# EAGLE design Bluetooth Bee_ Standalone v1.0 (EAGLE 6.1)
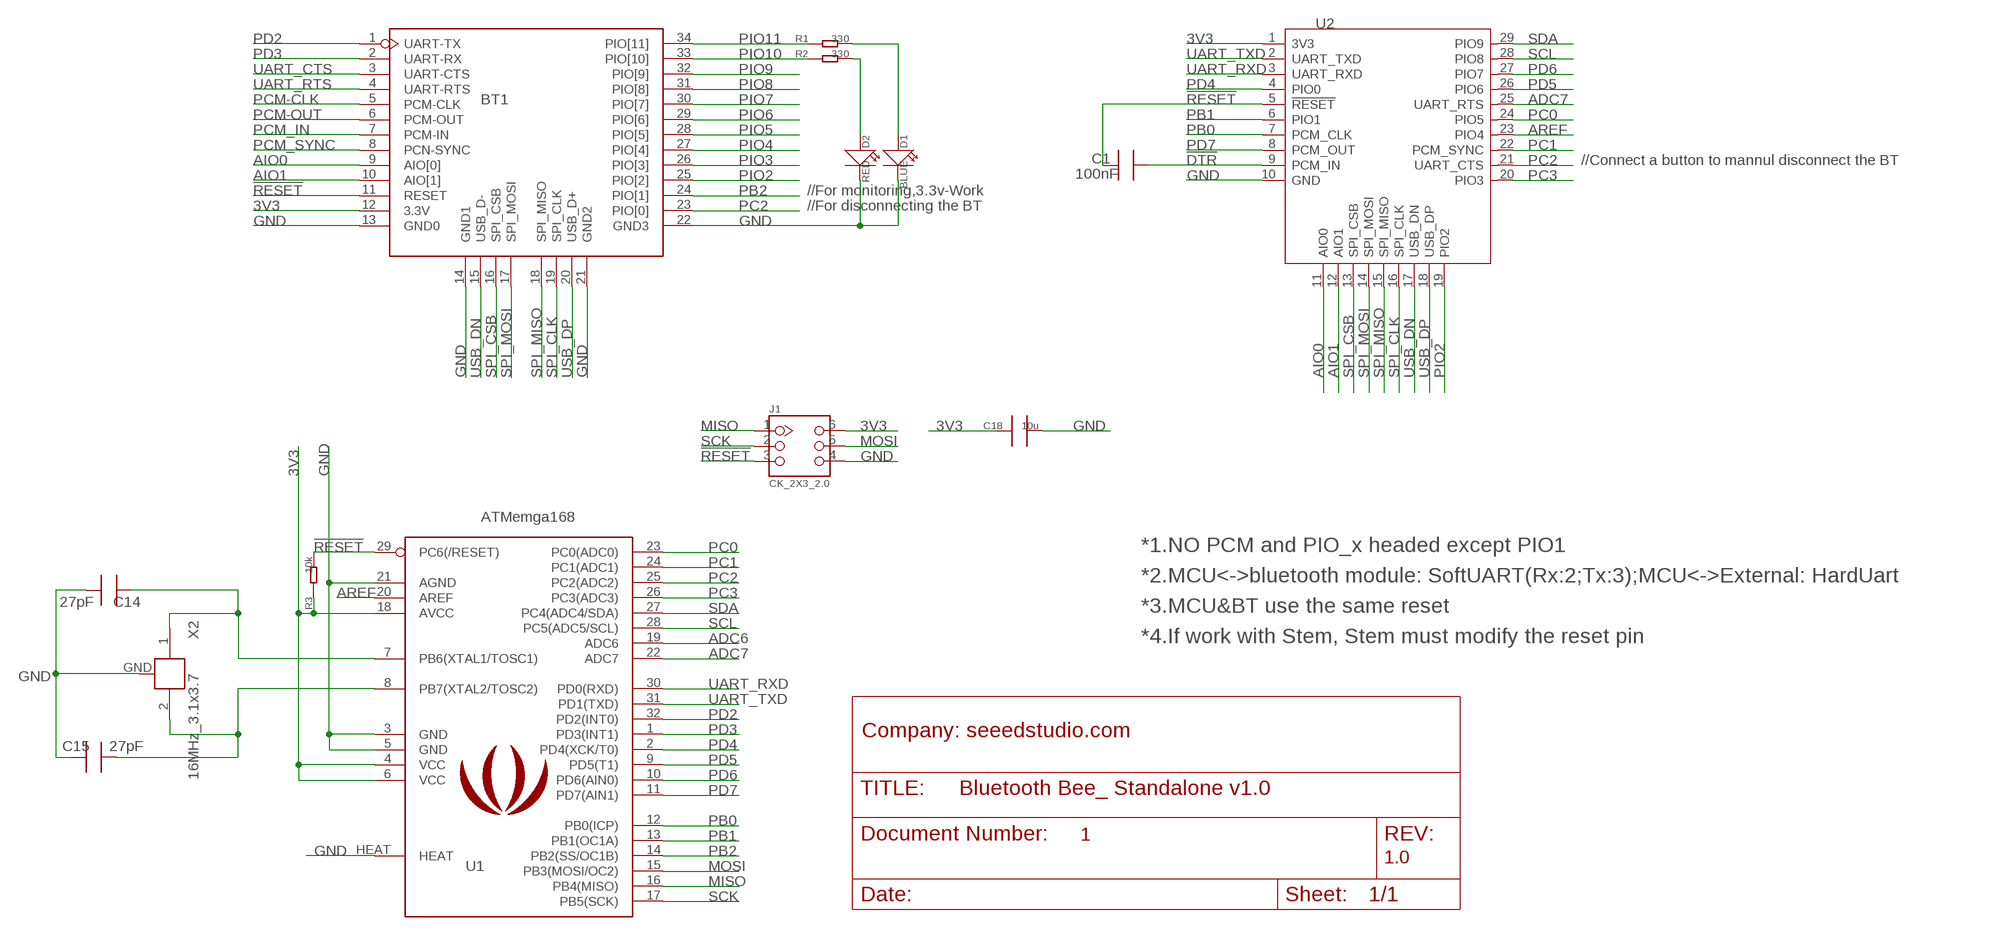
[diagram p0: schematic, sheet 1]

## Parts
BT1  SERIAL_BLUETEETHSMT  [SERIAL_BLUETEETH]
C1  100nF  C0603_S  [0603_S]
C14  27pF  C0603  [0603]
C15  27pF  C0603  [0603]
C18  10u  C0805  [0805]
D1  BLUE  LED0603  [LED0603]
D2  RED  LED0603  [LED0603]
J1  CK_2X3_2.0  [CK_2X3_2.0]
LOGO1  LOGO_SILK  [LOGO_SILK]
R1  330  R0603  [0603]
R2  330  R0603  [0603]
R3  10k  R0603_S  [0603_S@1]
U1  ATMemga168  MEGA8  [MLF32X]
U2  BLUTOOTHBEE-MS  [29P-DIP-2.0]
X2  16MHz_3.1x3.7  XTAL_NCHOZ  [XTAL_NC]

## Nets
3V3: BT1.12(3.3V) C18.1 J1.6 R3.1 U1.4(VCC) U1.6(VCC) U1.18(AVCC) U2.1(3V3)
!DTR: C1.1 U2.9(PCM_IN)
!RESET: BT1.11(RESET) C1.2 J1.3 R3.2 U1.29(PC6(/RESET)) U2.5(!RESET)
ADC6: U1.19(ADC6)
ADC7: U1.22(ADC7) U2.25(UART_RTS)
AIO0: BT1.9(AIO[0]) U2.11(AIO0)
AIO1: BT1.10(AIO[1]) U2.12(AIO1)
AREF: U1.20(AREF) U2.23(PIO4)
GND: BT1.13(GND0) BT1.14(GND1) BT1.21(GND2) BT1.22(GND3) C14.2 C15.1 C18.2 D1.2(-) D2.2(-) J1.4 U1.3(GND) U1.5(GND) U1.21(AGND) U1.HEAT U2.10(GND) X2.GND
MISO: J1.1 U1.16(PB4(MISO))
MOSI: J1.5 U1.15(PB3(MOSI/OC2))
N$1: D2.1(+) R2.2
N$2: D1.1(+) R1.2
PB0: U1.12(PB0(ICP)) U2.7(PCM_CLK)
PB1: U1.13(PB1(OC1A)) U2.6(PIO1)
PB2: BT1.24(PIO[1]) U1.14(PB2(SS/OC1B))
PC0: U1.23(PC0(ADC0)) U2.24(PIO5)
PC1: U1.24(PC1(ADC1)) U2.22(PCM_SYNC)
PC2: BT1.23(PIO[0]) U1.25(PC2(ADC2)) U2.21(UART_CTS)
PC3: U1.26(PC3(ADC3)) U2.20(PIO3)
PCM-CLK: BT1.5(PCM-CLK)
PCM-OUT: BT1.6(PCM-OUT)
PCM_IN: BT1.7(PCM-IN)
PCM_SYNC: BT1.8(PCN-SYNC)
PD2: BT1.1(UART-TX) U1.32(PD2(INT0))
PD3: BT1.2(UART-RX) U1.1(PD3(INT1))
PD4: U1.2(PD4(XCK/T0)) U2.4(PIO0)
PD5: U1.9(PD5(T1)) U2.26(PIO6)
PD6: U1.10(PD6(AIN0)) U2.27(PIO7)
PD7: U1.11(PD7(AIN1)) U2.8(PCM_OUT)
PIO2: BT1.25(PIO[2]) U2.19(PIO2)
PIO3: BT1.26(PIO[3])
PIO4: BT1.27(PIO[4])
PIO5: BT1.28(PIO[5])
PIO6: BT1.29(PIO[6])
PIO7: BT1.30(PIO[7])
PIO8: BT1.31(PIO[8])
PIO9: BT1.32(PIO[9])
PIO10: BT1.33(PIO[10]) R2.1
PIO11: BT1.34(PIO[11]) R1.1
SCK: J1.2 U1.17(PB5(SCK))
SCL: U1.28(PC5(ADC5/SCL)) U2.28(PIO8)
SDA: U1.27(PC4(ADC4/SDA)) U2.29(PIO9)
SPI_CLK: BT1.19(SPI_CLK) U2.16(SPI_CLK)
SPI_CSB: BT1.16(SPI_CSB) U2.13(SPI_CSB)
SPI_MISO: BT1.18(SPI_MISO) U2.15(SPI_MISO)
SPI_MOSI: BT1.17(SPI_MOSI) U2.14(SPI_MOSI)
UART_CTS: BT1.3(UART-CTS)
UART_RTS: BT1.4(UART-RTS)
UART_RXD: U1.30(PD0(RXD)) U2.3(UART_RXD)
UART_TXD: U1.31(PD1(TXD)) U2.2(UART_TXD)
USB_DN: BT1.15(USB_D-) U2.17(USB_DN)
USB_DP: BT1.20(USB_D+) U2.18(USB_DP)
XTAL1: C14.1 U1.7(PB6(XTAL1/TOSC1)) X2.1
XTAL2: C15.2 U1.8(PB7(XTAL2/TOSC2)) X2.2

## Notes on the sheet
- //Connect a button to mannul disconnect the BT
- //For monitoring,3.3v-Work
- //For disconnecting the BT
- *1.NO PCM and PIO_x headed except PIO1
- *2.MCU<->bluetooth module: SoftUART(Rx:2;Tx:3);MCU<->External: HardUart
- *3.MCU&BT use the same reset
- *4.If work with Stem, Stem must modify the reset pin
- Company: seeedstudio.com
- 1
- 1.0

## Library data of the parts
BT1 = EXT_moudle:SERIAL_BLUETEETH
C1 = CPT_SMD:C0603
C14 C15 = CPT_SMD:C0603; C0603: 100N
C18 = CPT_SMD:C0805
D1 D2 = CPT_SMD:LED0603
J1 = CONNECTER:CK_2X3
LOGO1 = logo:LOGO_SILK
R1-R3 = CPT_SMD:R0603
U1 = ICs_v54:MEGA8
U2 = Module:BLUTOOTHBEE-MS
X2 = CPT_SMD:XTAL_NC

## Net classes
0 default: width 0.203 mm, drill 0.305 mm, clearance 0.152 mm

## Board
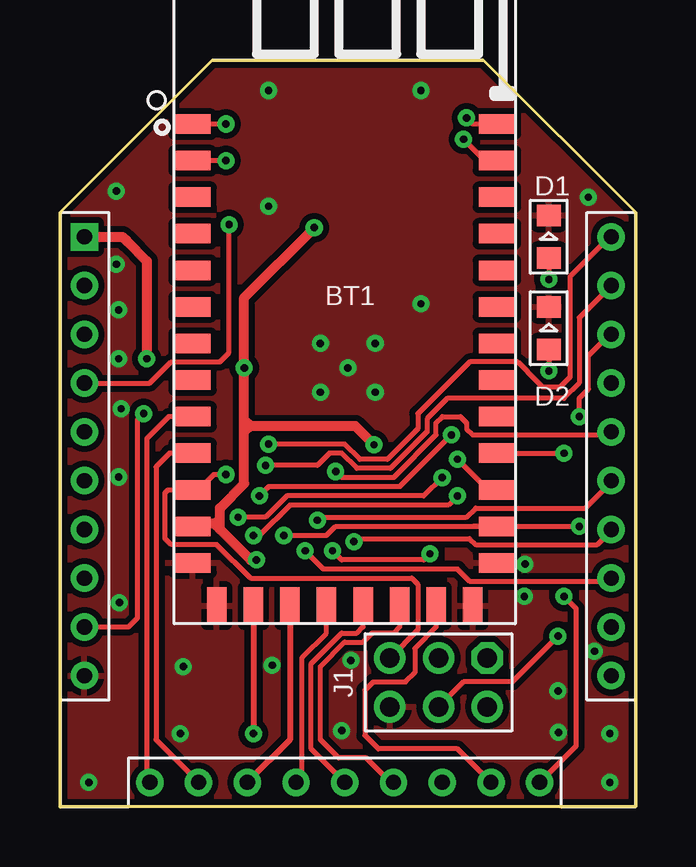
[diagram p1: board, top side]
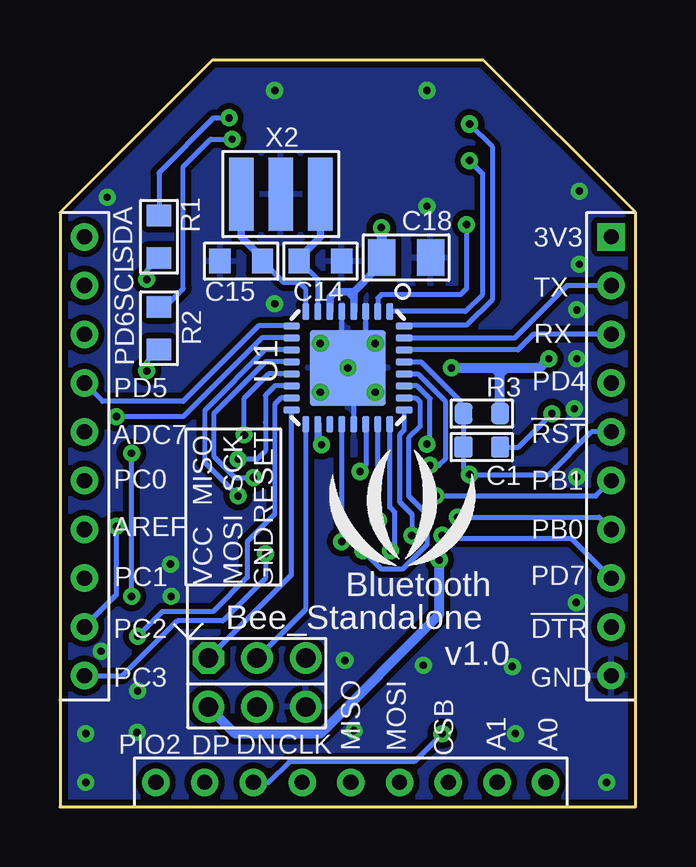
[diagram p2: board, bottom side, seen from below]

Size 24 x 31.12 mm. Coordinates in mm from the lower left corner, seen from the top.
Outline: 0,24.77 6.35,31.12 17.65,31.12 24,24.77 24,0 0,0 0,24.77
Copper layers (1*16): Top 0.035mm / dielectric 1.5mm / Bottom 0.035mm
Design rules: minimum track width 5mil, minimum drill 12mil, track to track 6mil, track to pad 6mil, pad to pad 6mil, via to via 6mil, smd to smd 0mil, copper to edge 10mil, drill to drill 8mil, minimum pad ring 10mil, minimum via ring 8mil, stop-mask expansion 4mil, vias tented up to drill 100mil, thermal gap 10mil

### Footprints (pad centres in the part's own frame; a part is rotated, then mirrored left to right if it is on the bottom)
SERIAL_BLUETEETH = smd 1.524 x 0.813: 1 -6.35,0; 2 -6.35,-1.524; 3 -6.35,-3.048; 4 -6.35,-4.572; 5 -6.35,-6.096; 6 -6.35,-7.62; 7 -6.35,-9.144; 8 -6.35,-10.668; 9 -6.35,-12.192; 10 -6.35,-13.716; 11 -6.35,-15.24; 12 -6.35,-16.764; 13 -6.35,-18.288; 22 6.35,-18.288; 23 6.35,-16.764; 24 6.35,-15.24; 25 6.35,-13.716; 26 6.35,-12.192; 27 6.35,-10.668; 28 6.35,-9.144; 29 6.35,-7.62; 30 6.35,-6.096; 31 6.35,-4.572; 32 6.35,-3.048; 33 6.35,-1.524; 34 6.35,0 | smd 0.813 x 1.524: 14 -5.334,-20.066; 15 -3.81,-20.066; 16 -2.286,-20.066; 17 -0.762,-20.066; 18 0.762,-20.066; 19 2.286,-20.066; 20 3.81,-20.066; 21 5.334,-20.066
0603_S = smd 0.762 x 0.889: 1 -0.762,0; 2 0.762,0
0603 = smd 0.889 x 1.016: 1 -0.889,0; 2 0.889,0
0805 = smd 1.143 x 1.524: 1 -1.016,0; 2 1.016,0
LED0603 = smd 0.889 x 1.016: 1 -0.889,0; 2 0.889,0
CK_2X3_2.0 = drill 0.813 pad 1.27 octagon: 1 -1.016,2.032 | drill 0.813 pad 1.27: 2 -1.016,0; 3 -1.016,-2.032; 4 1.016,-2.032; 5 1.016,0; 6 1.016,2.032
0603_S@1 = smd 0.762 x 0.889: 1 -0.762,0; 2 0.762,0
MLF32X = smd 0.7 x 0.3: 1 -2.35,1.75; 2 -2.35,1.25; 3 -2.35,0.75; 4 -2.35,0.25; 5 -2.35,-0.25; 6 -2.35,-0.75; 7 -2.35,-1.25; 8 -2.35,-1.75; 17 2.35,-1.75; 18 2.35,-1.25; 19 2.35,-0.75; 20 2.35,-0.25; 21 2.35,0.25; 22 2.35,0.75; 23 2.35,1.25; 24 2.35,1.75 | smd 0.3 x 0.7: 9 -1.75,-2.35; 10 -1.25,-2.35; 11 -0.75,-2.35; 12 -0.25,-2.35; 13 0.25,-2.35; 14 0.75,-2.35; 15 1.25,-2.35; 16 1.75,-2.35; 25 1.75,2.35; 26 1.25,2.35; 27 0.75,2.35; 28 0.25,2.35; 29 -0.25,2.35; 30 -0.75,2.35; 31 -1.25,2.35; 32 -1.75,2.35 | smd 3.175 x 3.175: HEAT 0,0
29P-DIP-2.0 = drill 0.635 pad 1.143 square: 1 -10.986,8.128 | drill 0.635 pad 1.143: 2 -10.986,6.096; 3 -10.986,4.064; 4 -10.986,2.032; 5 -10.986,0; 6 -10.986,-2.032; 7 -10.986,-4.064; 8 -10.986,-6.096; 9 -10.986,-8.128; 10 -10.986,-10.16; 11 -8.255,-14.605; 12 -6.223,-14.605; 13 -4.191,-14.605; 14 -2.159,-14.605; 15 -0.127,-14.605; 16 1.905,-14.605; 17 3.937,-14.605; 18 5.969,-14.605; 19 8.001,-14.605; 20 10.986,-10.16; 21 10.986,-8.128; 22 10.986,-6.096; 23 10.986,-4.064; 24 10.986,-2.032; 25 10.986,0; 26 10.986,2.032; 27 10.986,4.064; 28 10.986,6.096; 29 10.986,8.128
XTAL_NC = smd 1.016 x 3.048: 1 -1.651,0; 2 1.651,0; GND 0,0

### Placement (x,y rotation side)
BT1  11.87,28.45 0 top
C1  6.41,14.99 180 bottom
C14  13.14,22.73 0 bottom
C15  16.45,22.73 0 bottom
C18  9.56,22.89 0 bottom
D1  20.38,23.75 90 top
D2  20.38,19.94 90 top
J1  15.79,5.18 270 top
LOGO1  9.74,11.73 0 bottom
R1  19.88,23.75 270 bottom
R2  19.88,19.94 270 bottom
R3  6.41,16.38 180 bottom
U1  12,18.29 270 bottom
U2  12,15.62 0 top
X2  14.8,25.53 180 bottom

### Tracks (layer width: path | path; a pad name or v marks a point on that pad's centre or on a via)
3V3  (via drill 0.3 pad 0.64)
  Top 0.406: 7.68,15.62 7.68,15.88 | 7.68,15.88 7.68,16.13 | 7.68,15.88 7.94,15.88 | 7.94,15.88 7.68,16.13 | 7.68,15.62 7.94,15.88 | 7.68,16.13 v7.68,18.29 7.68,21.21 v10.6,24.13 | 7.94,15.88 12.31,15.88 v13.09,15.09 | BT1.12 5.65,11.81 6.41,11.81 | 7.68,15.62 7.68,13.46 6.67,12.45 6.67,11.99 | v3.62,18.67 3.62,22.73 2.79,23.56 2.6,23.75 U2.1 | v8.19,10.29 7.94,10.29 6.67,11.56 | 6.67,11.56 6.67,11.81 | 6.67,11.81 6.67,11.99 | 6.49,11.81 6.67,11.81 | 6.41,11.81 6.49,11.81 | 6.49,11.81 6.67,11.99 | 6.41,11.81 6.67,11.56
  Bottom 0.305: U1.4 11.75,21.21 | 11.75,21.21 11.75,21.46 | 11.75,21.46 10.86,22.35 10.86,22.61 C18.1 | U1.6 12.75,21.22 12.51,21.46 12,21.46 | 12,21.46 11.76,21.46 11.75,21.46 | 11.75,21.21 12,21.46 | U1.18 13.25,15.25 v13.09,15.09
  Bottom 0.406: v3.62,18.67 4,18.29 5.4,18.29 | v7.68,18.29 5.91,18.29 | 5.91,18.29 5.65,18.29 | 5.65,18.29 5.4,18.29 | R3.1 5.65,18.03 | 5.65,18.03 5.65,18.29 | 5.65,18.03 5.4,18.29 | 5.65,18.03 5.91,18.29 | C18.1 10.58,24.11 v10.6,24.13 | v8.19,10.29 8.19,8 13.14,3.05 16.7,3.05 J1.6
!DTR  (via drill 0.3 pad 0.64)
  Top 0.203: v3.49,16.38 3.24,16.13 3.24,7.87 2.86,7.49 U2.9
  Bottom 0.203: C1.1 4.89,14.99 v3.49,16.38
!RESET  (via drill 0.3 pad 0.64)
  Top 0.203: BT1.11 4.51,13.21 4.38,13.08 4.38,11.18 4.64,10.92 6.54,10.92 7.94,9.53 14.67,9.53 14.92,9.27 14.92,7.37 J1.3 | v6.92,13.84 6.41,13.84 5.78,13.21 BT1.11 | 5.91,13.21 BT1.11
  Bottom 0.203: 7.18,14.73 C1.2 R3.2 7.3,16.51 7.3,16.89 8.95,18.54 U1.29 | 7.05,14.73 7.18,14.73 | 7.18,14.73 7.18,14.1 v6.92,13.84 3.62,13.84 1.84,15.62 U2.5
ADC7  (via drill 0.3 pad 0.64)
  Top 0.203: v11.49,13.97 11.75,13.72 13.91,13.72 15.68,15.49 15.68,16 15.94,16.26 16.7,16.26 16.95,16 16.95,15.75 17.21,15.49 22.86,15.49 U2.25
  Bottom 0.203: U1.22 11.25,14.21 v11.49,13.97
AIO0
  Top 0.203: BT1.9 4.54,16.26 3.62,15.34 3.62,1.14 U2.11
AIO1
  Top 0.203: BT1.10 4.57,14.73 4,14.16 4,2.79 U2.12
AREF  (via drill 0.3 pad 0.64)
  Top 0.203: v12.26,11.05 12.38,11.18 17.08,11.18 17.34,10.92 22.42,10.92 22.99,11.49 U2.23
  Bottom 0.203: U1.20 v12.25,11.05 v12.26,11.05
GND  (via drill 0.3 pad 0.64)
  Bottom 0.203: U1.5 12.25,18.54 U1.HEAT | U1.3 11.25,19.04 U1.HEAT | U1.21 11.75,18.04 U1.HEAT
  other vias: 20.76,4.83 5.14,5.84 12,18.29 10.86,19.3 13.14,19.3 13.14,17.27 10.86,17.27 8.7,25.02 8.7,29.85 15.05,29.85 22.03,25.4 19.37,8.76 19.39,10.11 2.48,8.51 1.21,1.02 2.55,16.59 2.45,18.67 2.35,22.61 2.35,25.65 15.05,20.96 5.02,3.05 2.45,13.74 2.45,20.7 20.79,3.1 22.92,3.05 22.92,1.02 8.85,5.89 22.29,6.48 12.13,6.1 11.75,3.18
  pour Top (isolate 0.254): -0.57,31.37 24.19,31.37 24.19,-0.38 -0.57,-0.38
  pour Bottom (isolate 0.254): -0.57,31.37 24.19,31.37 24.19,-0.38 -0.57,-0.38
MISO
  Bottom 0.203: U1.16 14.35,9.66 J1.1
MOSI  (via drill 0.3 pad 0.64)
  Top 0.203: v20.76,7.11 18.86,5.21 16.83,5.21 J1.5
  Bottom 0.203: U1.15 14.78,17.04 15.05,16.76 15.05,12.19 16.19,11.05 16.19,9.55 17.62,8.13 19.75,8.13 v20.76,7.11
N$1  (via drill 0.3 pad 0.64)
  Top 0.203: D2.1 v20.38,18.16
  Bottom 0.203: v20.38,18.16 20.38,18.54 R2.2
N$2  (via drill 0.3 pad 0.64)
  Top 0.203: D1.1 v20.38,21.97
  Bottom 0.203: v20.38,21.97 20.38,22.35 R1.2
PB0  (via drill 0.3 pad 0.64)
  Top 0.203: v15.94,13.72 15.18,12.95 9.46,12.95 8.57,12.07 v7.43,12.07
  Bottom 0.203: U1.12 15.43,18.54 17.59,16.38 17.59,14.61 16.7,13.72 v15.94,13.72 | v7.43,12.07 1.52,12.07 U2.7
PB1  (via drill 0.3 pad 0.64)
  Top 0.203: v16.32,15.49 14.16,13.34 8.7,13.34 v8.32,12.95
  Bottom 0.203: 14.79,18.04 U1.13 15.3,18.03 16.32,17.02 v16.32,15.49 | v8.32,12.95 1.65,12.95 U2.6
PB2  (via drill 0.3 pad 0.64)
  Top 0.203: BT1.24 17.84,13.21 v16.57,14.48
  Bottom 0.203: U1.14 15.04,17.54 15.43,17.15 15.43,16 15.43,14.84 15.79,14.48 v16.57,14.48
PC0  (via drill 0.3 pad 0.64)
  Top 0.203: v10.73,11.94 10.86,12.07 16.95,12.07 17.34,12.45 21.91,12.45 22.99,13.53 U2.24
  Bottom 0.203: U1.23 10.75,11.96 v10.73,11.94
PC1  (via drill 0.3 pad 0.64)
  Top 0.203: v10.22,10.67 10.99,9.91 16.57,9.91 17.08,9.4 22.86,9.4 U2.22
  Bottom 0.203: U1.24 10.25,12.47 10.05,12.28 10.05,10.84 v10.22,10.67
PC2  (via drill 0.3 pad 0.64)
  Top 0.203: BT1.23 17.21,11.68 | v9.33,11.3 11.11,11.3 11.49,11.68 BT1.23 | BT1.23 v21.65,11.68
  Bottom 0.203: U1.25 9.65,15.69 9.84,15.49 9.84,12.7 9.33,12.19 v9.33,11.3 | v21.65,11.68 21.65,8.83 U2.21
PC3  (via drill 0.3 pad 0.64)
  Top 0.203: v15.43,10.54 15.18,10.29 11.75,10.29 v11.37,10.67
  Bottom 0.203: U1.26 9.63,17.02 9.14,17.02 8.98,16.86 8.98,15.85 9.46,15.37 9.46,12.95 8.7,12.19 8.7,10.92 9.72,9.91 10.6,9.91 v11.37,10.67 | v15.43,10.54 15.43,9.53 17.21,7.75 19.11,7.75 21.4,5.46 U2.20
PD2  (via drill 0.3 pad 0.64)
  Top 0.203: v6.92,28.45 BT1.1
  Bottom 0.203: U1.32 9.62,20.07 7.05,20.07 5.98,21.13 5.98,27.51 v6.92,28.45
PD3  (via drill 0.3 pad 0.64)
  Top 0.203: v6.92,26.92 BT1.2
  Bottom 0.203: U1.1 7.1,20.64 6.38,21.36 6.38,26.38 v6.92,26.92
PD4  (via drill 0.3 pad 0.64)
  Top 0.203: v7.05,24.26 7.05,18.92 6.67,18.54 4.64,18.54 3.75,17.65 U2.4
  Bottom 0.203: U1.2 10.75,21.19 10.6,21.34 7.3,21.34 7.05,21.59 v7.05,24.26
PD5
  Bottom 0.203: U1.9 15.71,20.04 18.86,16.89 22.23,16.89 U2.26
PD6  (via drill 0.3 pad 0.64)
  Top 0.203: v21.65,16.26 21.65,17.02 22.03,17.4 22.03,18.8 22.92,19.69 U2.27
  Bottom 0.203: U1.10 15.58,19.54 18.86,16.26 v21.65,16.26
PD7  (via drill 0.3 pad 0.64)
  Top 0.203: v16.57,12.95 16.19,12.57 9.59,12.57 8.32,11.3 v8.06,11.3
  Bottom 0.203: U1.11 15.44,19.04 17.97,16.51 17.97,14.35 v16.57,12.95 | v8.06,11.3 7.94,11.18 2.67,11.18 U2.8
PIO2  (via drill 0.3 pad 0.64)
  Top 0.203: BT1.25 v21.02,14.73 | v21.02,8.76 21.53,8.26 21.53,2.54 U2.19
  Bottom 0.203: v21.02,8.76 v21.02,14.73
PIO10  (via drill 0.3 pad 0.64)
  Top 0.203: BT1.33 17.72,26.92 v16.83,27.81
  Bottom 0.203: R2.1 19.62,20.83 18.86,21.59 18.86,26.67 17.72,27.81 v16.83,27.81
PIO11  (via drill 0.3 pad 0.64)
  Top 0.203: BT1.34 17.21,28.45 v16.95,28.7
  Bottom 0.203: v16.95,28.7 17.59,28.7 19.88,26.42 R1.1
SCK
  Bottom 0.203: U1.17 13.75,8.23 J1.2
SCL  (via drill 0.3 pad 0.64)
  Top 0.203: v8.57,14.22 10.73,14.22 11.24,14.73 11.75,14.73 12.38,14.1 13.78,14.1 15.3,15.62 15.3,16.17 16.16,17.02 21.02,17.02 21.65,17.65 21.65,20.38 U2.28
  Bottom 0.203: U1.28 9.08,18.04 7.94,16.89 7.94,14.48 8.19,14.22 v8.57,14.22
SDA  (via drill 0.3 pad 0.64)
  Top 0.203: v8.7,15.11 11.87,15.11 12.51,14.48 13.65,14.48 14.92,15.75 14.92,16.38 17.09,18.54 19.09,18.54 19.49,18.14 19.49,18.12 20.12,17.5 20.86,17.5 21.27,17.91 21.27,22.1 22.92,23.75 U2.29
  Bottom 0.203: U1.27 9.11,17.54 8.57,17 8.57,15.24 v8.7,15.11
SPI_CLK
  Top 0.203: BT1.19 14.16,7.49 13.91,7.24 13.02,7.24 12.64,6.86 11.87,6.86 10.86,5.84 10.86,2.79 11.62,2.03 12.76,2.03 13.78,1.02 U2.16
  Top 0.254: 14.16,7.98 BT1.19
SPI_CSB
  Top 0.254: BT1.16 9.59,2.79 U2.13
SPI_MISO
  Top 0.203: BT1.18 12.64,7.49 12.38,7.24 11.75,7.24 10.48,5.97 10.48,2.41 U2.15
SPI_MOSI
  Top 0.203: 11.11,8.51 BT1.17 11.11,7.24 10.1,6.22 10.1,1.27 U2.14
UART_RXD
  Bottom 0.203: U1.30 4.9,19.04 4.25,19.69 U2.3
UART_TXD
  Bottom 0.203: U1.31 5.04,19.54 2.86,21.72 U2.2
USB_DN  (via drill 0.3 pad 0.64)
  Top 0.254: BT1.15 v8.06,3.05
  Bottom 0.203: v8.06,3.05 9.21,1.91 14.41,1.91 15.3,1.02 U2.17
USB_DP
  Top 0.203: BT1.20 15.68,7.49 14.8,6.6 14.8,5.59 14.41,5.21 13.07,5.21 12.72,4.86 12.72,2.97 13.27,2.41 16.57,2.41 U2.18
XTAL1
  Bottom 0.203: U1.7 13.25,21.95 C14.1
  Bottom 0.305: C14.1 14.03,22.86 13.14,23.75 X2.1
XTAL2
  Bottom 0.203: U1.8 13.75,21.56 14.03,21.84 14.67,21.84 C15.2
  Bottom 0.305: C15.2 15.56,22.86 16.45,23.75 X2.2

### Text on the board
bPlace: SDA | 3V3 | SCL | TX | PD6 | RX | PD4 | PD5 | !RST | RESET | SCK | MISO | ADC7 | PB1 | PC0 | GND | MOSI | VCC | PB0 | AREF | PD7 | Bluetooth | PC1 | !DTR | Bee_Standalone | PC2 | v1.0 | GND | PC3 | A0 | A1 | CSB | CLK | MOSI | MISO | DN | DP | PIO2